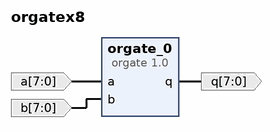
[diagram p0: block diagram of the top level]
# Vivado block design orgatex8, xc7a100tfgg484-1, Vivado 2017.4
create_bd_design orgatex8

create_bd_port -dir I -from 7 -to 0 a
create_bd_port -dir I -from 7 -to 0 b
create_bd_port -dir O -from 7 -to 0 q

create_bd_cell -type ip -vlnv CSE:CSE:orgate:1.0 orgate_0

# ---- connections ----

connect_bd_net [get_bd_ports a] [get_bd_pins orgate_0/a]
connect_bd_net [get_bd_ports b] [get_bd_pins orgate_0/b]
connect_bd_net [get_bd_pins orgate_0/q] [get_bd_ports q]

validate_bd_design
save_bd_design
